# EAGLE schematic Hiveopolis (EAGLE 9.6.2)
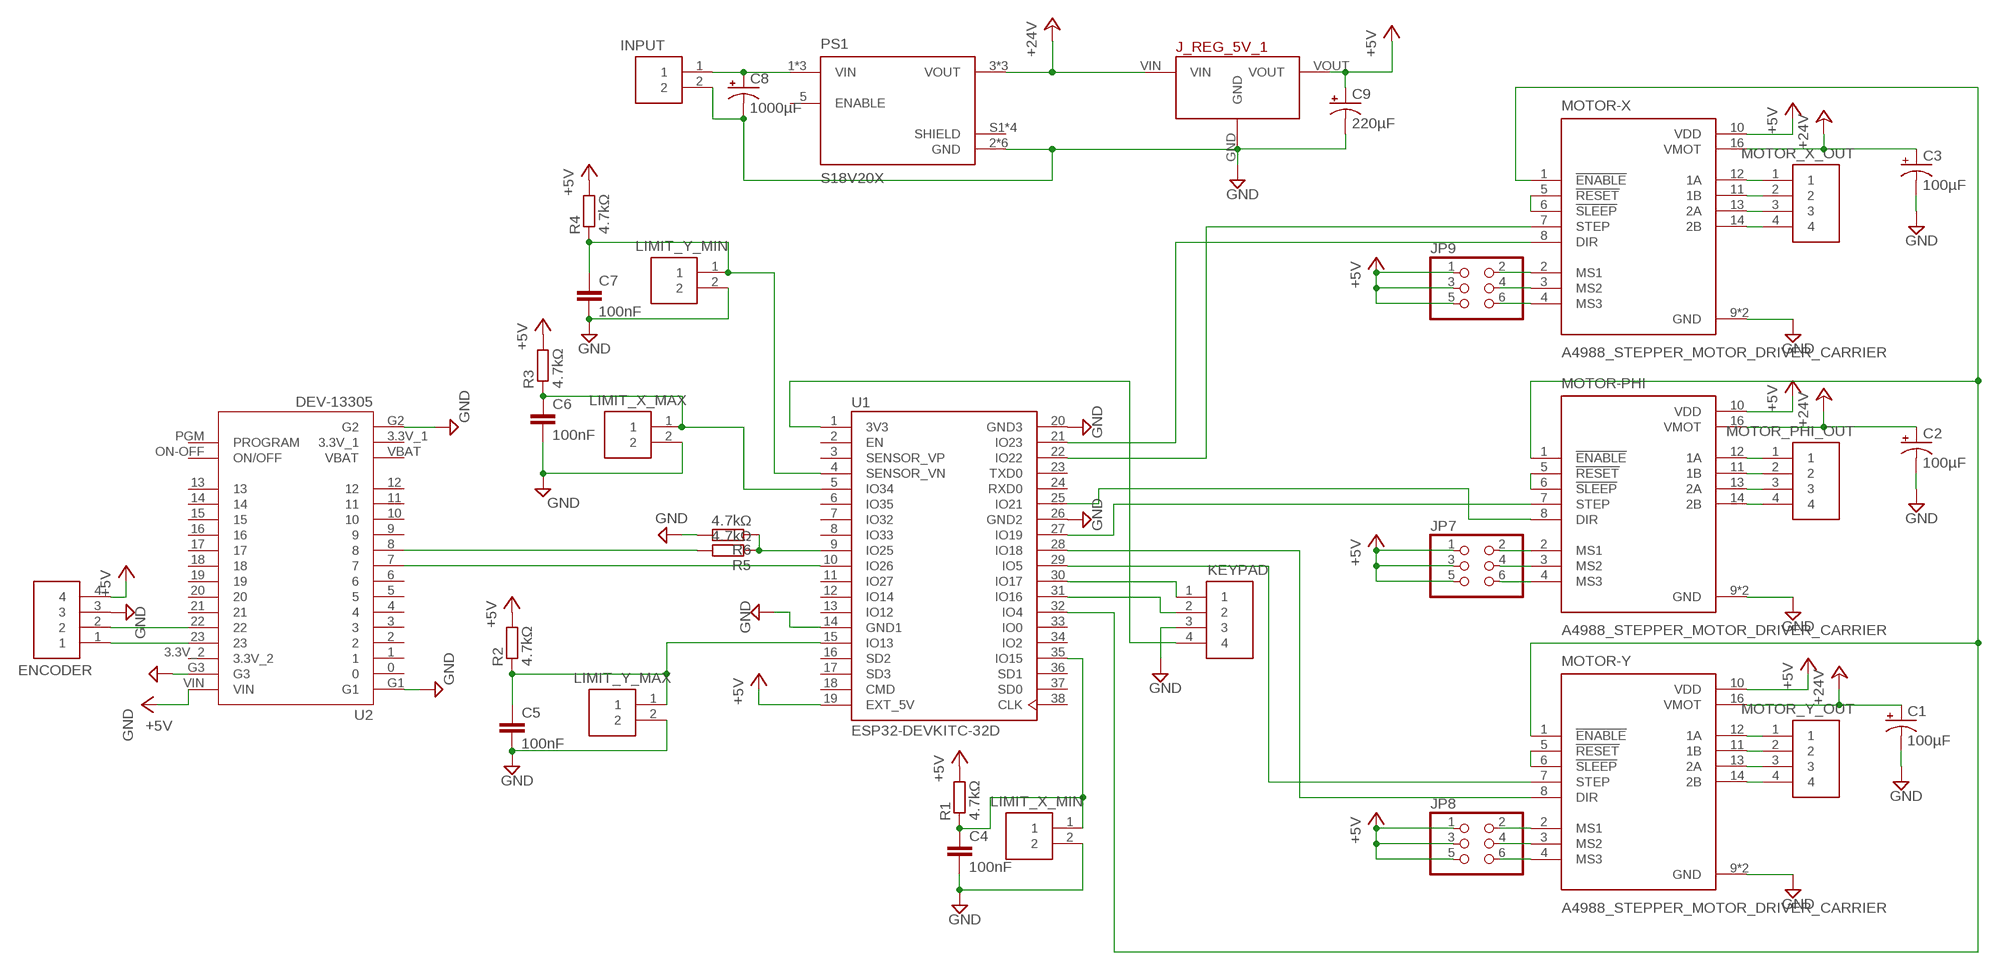
[diagram p0: schematic, sheet 1]

## Parts
C1  100µF  CPOL-USE5-5  [E5-5]
C2  100µF  CPOL-USE5-5  [E5-5]
C3  100µF  CPOL-USE5-5  [E5-5]
C4  100nF  C-EU025-024X044  [C025-024X044]
C5  100nF  C-EU025-024X044  [C025-024X044]
C6  100nF  C-EU025-024X044  [C025-024X044]
C7  100nF  C-EU025-024X044  [C025-024X044]
C8  1000µF  CPOL-USE5-10.5  [E5-10,5]
C9  220µF  CPOL-USE5-8.5  [E5-8,5]
ENCODER  S4B-XH-A(LF)(SN)  [HDR-04/RA]
INPUT  S2B-XH-A(LF)(SN)  [HDR-02/RA]
J_REG_5V_1  5V_VOLTAGE_REGULATOR  [5V_VOLTAGE_REGULATOR]
JP7  PINHD-2X3  [2X03]
JP8  PINHD-2X3  [2X03]
JP9  PINHD-2X3  [2X03]
KEYPAD  S4B-XH-A(LF)(SN)  [HDR-04/RA]
LIMIT_X_MAX  S2B-XH-A(LF)(SN)  [HDR-02/RA]
LIMIT_X_MIN  S2B-XH-A(LF)(SN)  [HDR-02/RA]
LIMIT_Y_MAX  S2B-XH-A(LF)(SN)  [HDR-02/RA]
LIMIT_Y_MIN  S2B-XH-A(LF)(SN)  [HDR-02/RA]
MOTOR-PHI  A4988_STEPPER_MOTOR_DRIVER_CARRIER  [MODULE_A4988_STEPPER_MOTOR_DRIVER_CARRIER]
MOTOR-X  A4988_STEPPER_MOTOR_DRIVER_CARRIER  [MODULE_A4988_STEPPER_MOTOR_DRIVER_CARRIER]
MOTOR-Y  A4988_STEPPER_MOTOR_DRIVER_CARRIER  [MODULE_A4988_STEPPER_MOTOR_DRIVER_CARRIER]
MOTOR_PHI_OUT  S4B-XH-A(LF)(SN)  [HDR-04/RA]
MOTOR_X_OUT  S4B-XH-A(LF)(SN)  [HDR-04/RA]
MOTOR_Y_OUT  S4B-XH-A(LF)(SN)  [HDR-04/RA]
PS1  S18V20X  [CONV_S18V20X]
R1  4.7kΩ  R-EU_0207/10  [0207/10]
R2  4.7kΩ  R-EU_0207/10  [0207/10]
R3  4.7kΩ  R-EU_0207/10  [0207/10]
R4  4.7kΩ  R-EU_0207/10  [0207/10]
R5  4.7kΩ  R-EU_0207/10  [0207/10]
R6  4.7kΩ  R-EU_0207/10  [0207/10]
U1  ESP32-DEVKITC-32D  [MODULE_ESP32-DEVKITC-32D]
U2  DEV-13305  [MODULE_DEV-13305]

## Nets
+5V: C9.+ ENCODER.4 J_REG_5V_1.VOUT JP7.1 JP7.3 JP7.5 JP8.1 JP8.3 JP8.5 JP9.1 JP9.3 JP9.5 MOTOR-PHI.10(VDD) MOTOR-X.10(VDD) MOTOR-Y.10(VDD) R1.2 R2.2 R3.2 R4.2 U1.19(EXT_5V) U2.VIN
+24V: C1.+ C2.+ C3.+ J_REG_5V_1.VIN MOTOR-PHI.16(VMOT) MOTOR-X.16(VMOT) MOTOR-Y.16(VMOT) PS1.3(VOUT) PS1.10(VOUT) PS1.11(VOUT)
GND: C1.- C2.- C3.- C4.2 C5.2 C6.2 C7.2 C8.- C9.- ENCODER.3 INPUT.2 J_REG_5V_1.GND KEYPAD.3 LIMIT_X_MAX.2 LIMIT_X_MIN.2 LIMIT_Y_MAX.2 LIMIT_Y_MIN.2 MOTOR-PHI.9(GND) MOTOR-PHI.15(GND) MOTOR-X.9(GND) MOTOR-X.15(GND) MOTOR-Y.9(GND) MOTOR-Y.15(GND) PS1.2(GND) PS1.4(GND) PS1.8(GND) PS1.9(GND) PS1.12(GND) PS1.13(GND) R6.2 U1.14(GND1) U1.20(GND3) U1.26(GND2) U2.G1 U2.G2 U2.G3
N$1: MOTOR-X.7(STEP) U1.22(IO22)
N$2: MOTOR-X.8(DIR) U1.21(IO23)
N$3: R5.2 U2.8
N$4: JP9.2 MOTOR-X.2(MS1)
N$5: MOTOR-PHI.8(DIR) U1.25(IO21)
N$6: MOTOR-Y.7(STEP) U1.29(IO5)
N$7: C5.1 LIMIT_Y_MAX.1 R2.1 U1.15(IO13)
N$8: MOTOR-PHI.7(STEP) U1.27(IO19)
N$9: MOTOR-X.12(1A) MOTOR_X_OUT.1
N$10: MOTOR-X.11(1B) MOTOR_X_OUT.2
N$11: MOTOR-X.13(2A) MOTOR_X_OUT.3
N$12: MOTOR-X.14(2B) MOTOR_X_OUT.4
N$13: JP9.4 MOTOR-X.3(MS2)
N$14: JP9.6 MOTOR-X.4(MS3)
N$15: JP7.2 MOTOR-PHI.2(MS1)
N$16: JP7.4 MOTOR-PHI.3(MS2)
N$17: MOTOR-PHI.12(1A) MOTOR_PHI_OUT.1
N$18: MOTOR-PHI.11(1B) MOTOR_PHI_OUT.2
N$19: MOTOR-PHI.13(2A) MOTOR_PHI_OUT.3
N$20: MOTOR-PHI.14(2B) MOTOR_PHI_OUT.4
N$21: MOTOR-Y.12(1A) MOTOR_Y_OUT.1
N$22: MOTOR-Y.11(1B) MOTOR_Y_OUT.2
N$23: MOTOR-Y.13(2A) MOTOR_Y_OUT.3
N$24: MOTOR-Y.14(2B) MOTOR_Y_OUT.4
N$25: JP7.6 MOTOR-PHI.4(MS3)
N$26: JP8.2 MOTOR-Y.2(MS1)
N$27: C6.1 LIMIT_X_MAX.1 R3.1 U1.5(IO34)
N$28: U1.10(IO26) U2.7
N$29: KEYPAD.1 U1.30(IO17)
N$30: C7.1 LIMIT_Y_MIN.1 R4.1 U1.4(SENSOR_VN)
N$31: JP8.4 MOTOR-Y.3(MS2)
N$32: JP8.6 MOTOR-Y.4(MS3)
N$33: KEYPAD.2 U1.31(IO16)
N$34: KEYPAD.4 U1.1(3V3)
N$35: C4.1 LIMIT_X_MIN.1 R1.1 U1.35(IO15)
N$36: MOTOR-PHI.5(!RESET) MOTOR-PHI.6(!SLEEP)
N$37: MOTOR-PHI.1(!ENABLE) MOTOR-X.1(!ENABLE) MOTOR-Y.1(!ENABLE) U1.32(IO4)
N$38: R5.1 R6.1 U1.9(IO25)
N$39: C8.+ INPUT.1 PS1.1(VIN) PS1.6(VIN) PS1.7(VIN)
N$40: MOTOR-Y.5(!RESET) MOTOR-Y.6(!SLEEP)
N$41: MOTOR-Y.8(DIR) U1.28(IO18)
N$42: MOTOR-X.5(!RESET) MOTOR-X.6(!SLEEP)
N$43: ENCODER.1 U2.23
N$44: ENCODER.2 U2.22
Unconnected: PS1.5(ENABLE) PS1.S1(SHIELD) PS1.S2(SHIELD) PS1.S3(SHIELD) PS1.S4(SHIELD) U1.2(EN) U1.3(SENSOR_VP) U1.6(IO35) U1.7(IO32) U1.8(IO33) U1.11(IO27) U1.12(IO14) U1.13(IO12) U1.16(SD2) U1.17(SD3) U1.18(CMD) U1.23(TXD0) U1.24(RXD0) U1.33(IO0) U1.34(IO2) U1.36(SD1) U1.37(SD0) U1.38(CLK) U2.0 U2.1 U2.2 U2.3 U2.4 U2.5 U2.6 U2.9 U2.10 U2.11 U2.12 U2.13 U2.14 U2.15 U2.16 U2.17 U2.18 U2.19 U2.20 U2.21 U2.ON-OFF(ON/OFF) U2.PGM(PROGRAM)

## Power pins joined to a net without a drawn wire
3.3V_1: U2.3.3V_1
3.3V_2: U2.3.3V_2
VBAT: U2.VBAT

## Library data of the parts
C1-C3 C8 C9 = rcl:CPOL-US: POLARIZED CAPACITOR, American symbol; SPICEPREFIX: C
C4-C7 = rcl:C-EU: CAPACITOR, European symbol; SPICEPREFIX: C
ENCODER KEYPAD MOTOR_PHI_OUT MOTOR_X_OUT MOTOR_Y_OUT = Connectors:S4B-XH-A(LF)(SN): CONN HEADER R/A 4POS 2.5MM Manufacturer's datasheet <http://www.jst-mfg.com/product/pdf/eng/eXH.pdf>; CREATED_BY: PCBLayout.com; DIGIKEY_PART_NUMBER: 455-2243-ND; MANUFACTURER: JST Sales America Inc.; MPN: S4B-XH-A(LF)(SN)
INPUT LIMIT_X_MAX LIMIT_X_MIN LIMIT_Y_MAX LIMIT_Y_MIN = Connectors:S2B-XH-A(LF)(SN): PT11502HBBN Manufacturer's datasheet <https://www.metz-connect.com/html/overlay:service:download.en.html?filepath=db%3Aproducts%2Fdocid%3A8a8a80ea7fb5a125017fdc523f72594c.de.1&fileurl=313301%2F904704.PDF>; CREATED_BY: praked; MANUFACTURER: METZ Connect; MPN: PT11502HBBN
J_REG_5V_1 = Pololu Voltage Regulators:5V_VOLTAGE_REGULATOR: Polulu 5V Step-Up/Step-Down Voltage REgulator S7V7F5
JP7-JP9 = pinhead:PINHD-2X3: PIN HEADER
MOTOR-PHI MOTOR-X MOTOR-Y = A4988_STEPPER_MOTOR_DRIVER_CARRIER:A4988_STEPPER_MOTOR_DRIVER_CARRIER: Stepper motor controler; IC: A4988; 1A; Uin mot: 8÷35V Check prices <https://pricing.snapeda.com/parts/A4988%20STEPPER%20MOTOR%20DRIVER%20CARRIER/Pololu/view-part?ref=eda>; AVAILABILITY: No availability data; DESCRIPTION: Stepper Motor Driver; MF: Pololu; MP: A4988 STEPPER MOTOR DRIVER CARRIER; PACKAGE: None; PRICE: None
PS1 = S18V20X:S18V20X: Step-up/Step-Down Voltage Regulators Check availability <https://pricing.snapeda.com/parts/S18V20x/Pololu/view-part?ref=eda>; AVAILABILITY: Not in stock; DESCRIPTION: Step-up/Step-Down Voltage Regulators; MF: Pololu; MP: S18V20x; PACKAGE: Package; PRICE: None
R1-R6 = rcl:R-EU_: RESISTOR, European symbol; SPICEPREFIX: R
U1 = ESP32-DEVKITC-32D:ESP32-DEVKITC-32D: Eval Board For Esp-Wroom-32 Check availability <https://pricing.snapeda.com/parts/ESP32-DEVKITC-32D/Espressif%20Systems/view-part?ref=eda>; AVAILABILITY: In Stock; DESCRIPTION: WiFi Development Tools (802.11) ESP32 General Development Kit, ESP32-WROOM-32D on the board; MF: Espressif Systems; MP: ESP32-DEVKITC-32D; PACKAGE: None; PRICE: None; PURCHASE-URL: https://pricing.snapeda.com/search/part/ESP32-DEVKITC-32D/?ref=eda
U2 = DEV-13305:DEV-13305: RT1062 Teensy 4.0 i.MX ARM® Cortex®-M7 MPU Embedded Evaluation Board Check availability <https://pricing.snapeda.com/parts/DEV-15583/SparkFun%20Electronics/view-part?ref=eda>; AVAILABILITY: In Stock; DESCRIPTION: RT1062 Teensy 4.0 series ARM® Cortex®-M7 MPU Embedded Evaluation Board; MF: SparkFun Electronics; MP: DEV-15583; PACKAGE: None; PRICE: None; PURCHASE-URL: https://pricing.snapeda.com/search/part/DEV-15583/?ref=eda